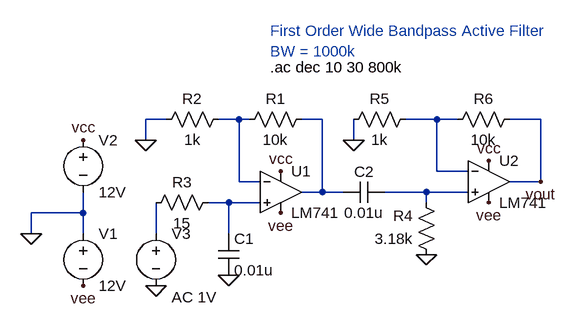
[diagram p0: schematic wide_bandpass_first_order.asc]
wide_bandpass_first_order.asc, the LTspice schematic file:
Version 4.1
SHEET 1 880 680
WIRE 128 32 96 32
WIRE 240 32 208 32
WIRE 256 32 240 32
WIRE 368 32 336 32
WIRE 544 32 496 32
WIRE 576 32 544 32
WIRE 704 32 656 32
WIRE 96 64 96 32
WIRE 416 64 416 32
WIRE 544 112 544 32
WIRE 592 112 544 112
WIRE 240 128 240 32
WIRE 272 128 240 128
WIRE 704 128 704 32
WIRE 704 128 656 128
WIRE 368 144 368 32
WIRE 368 144 336 144
WIRE 400 144 368 144
WIRE 528 144 464 144
WIRE 592 144 528 144
WIRE 224 160 192 160
WIRE 272 160 224 160
WIRE 528 160 528 144
WIRE 0 176 0 144
WIRE 0 176 -80 176
WIRE -80 208 -80 176
WIRE 0 208 0 176
WIRE 112 208 112 160
WIRE 224 208 224 160
FLAG -80 208 0
FLAG 0 64 vcc
FLAG 304 112 vcc
FLAG 624 96 vcc
FLAG 304 176 vee
FLAG 0 288 vee
FLAG 624 160 vee
FLAG 112 288 0
FLAG 96 64 0
FLAG 416 64 0
FLAG 224 272 0
FLAG 528 240 0
FLAG 704 128 vout
SYMBOL voltage 0 192 R0
WINDOW 123 0 0 Left 0
WINDOW 39 0 0 Left 0
SYMATTR InstName V1
SYMATTR Value 12V
SYMBOL voltage 0 48 R0
WINDOW 123 0 0 Left 0
WINDOW 39 0 0 Left 0
SYMATTR InstName V2
SYMATTR Value 12V
SYMBOL LM741 304 80 R0
SYMATTR InstName U1
SYMBOL LM741 624 64 R0
SYMATTR InstName U2
SYMBOL res 352 16 R90
WINDOW 0 0 56 VBottom 2
WINDOW 3 32 56 VTop 2
SYMATTR InstName R1
SYMATTR Value 10k
SYMBOL res 224 16 R90
WINDOW 0 0 56 VBottom 2
WINDOW 3 32 56 VTop 2
SYMATTR InstName R2
SYMATTR Value 1k
SYMBOL cap 208 208 R0
SYMATTR InstName C1
SYMATTR Value 0.01u
SYMBOL res 208 144 R90
WINDOW 0 0 56 VBottom 2
WINDOW 3 32 56 VTop 2
SYMATTR InstName R3
SYMATTR Value 15
SYMBOL voltage 112 192 R0
WINDOW 123 24 114 Left 2
WINDOW 39 0 0 Left 0
SYMATTR Value2 AC 1V
SYMATTR InstName V3
SYMATTR Value ""
SYMBOL res 544 256 R180
WINDOW 0 36 76 Left 2
WINDOW 3 36 40 Left 2
SYMATTR InstName R4
SYMATTR Value 3.18k
SYMBOL cap 464 128 R90
WINDOW 0 0 32 VBottom 2
WINDOW 3 32 32 VTop 2
SYMATTR InstName C2
SYMATTR Value 0.01u
SYMBOL res 512 16 R90
WINDOW 0 0 56 VBottom 2
WINDOW 3 32 56 VTop 2
SYMATTR InstName R5
SYMATTR Value 1k
SYMBOL res 672 16 R90
WINDOW 0 0 56 VBottom 2
WINDOW 3 32 56 VTop 2
SYMATTR InstName R6
SYMATTR Value 10k
TEXT 288 -104 Left 2 ;First Order Wide Bandpass Active Filter \nBW = 1000k
TEXT 288 -48 Left 2 !.ac dec 10 30 800k

The netlist it stands for:
* wide_bandpass_first_order.asc
V1 0 vee 12V
V2 vcc 0 12V
X§U1 N005 N001 vcc vee N002 LM741  ; pins In+ In- V+ V- OUT
X§U2 N004 N003 vcc vee vout LM741  ; pins In+ In- V+ V- OUT
R1 N002 N001 10k
R2 N001 0 1k
C1 N005 0 0.01u
R3 N005 N006 15
V3 N006 0 AC 1V
R4 0 N004 3.18k
C2 N004 N002 0.01u
R5 N003 0 1k
R6 vout N003 10k
* First Order Wide Bandpass Active Filter
* BW = 1000k
.ac dec 10 30 800k
.lib LM741.lib
.backanno
.end